# Altium project SR8_MPPT.PrjPcb (part 1 of 3)
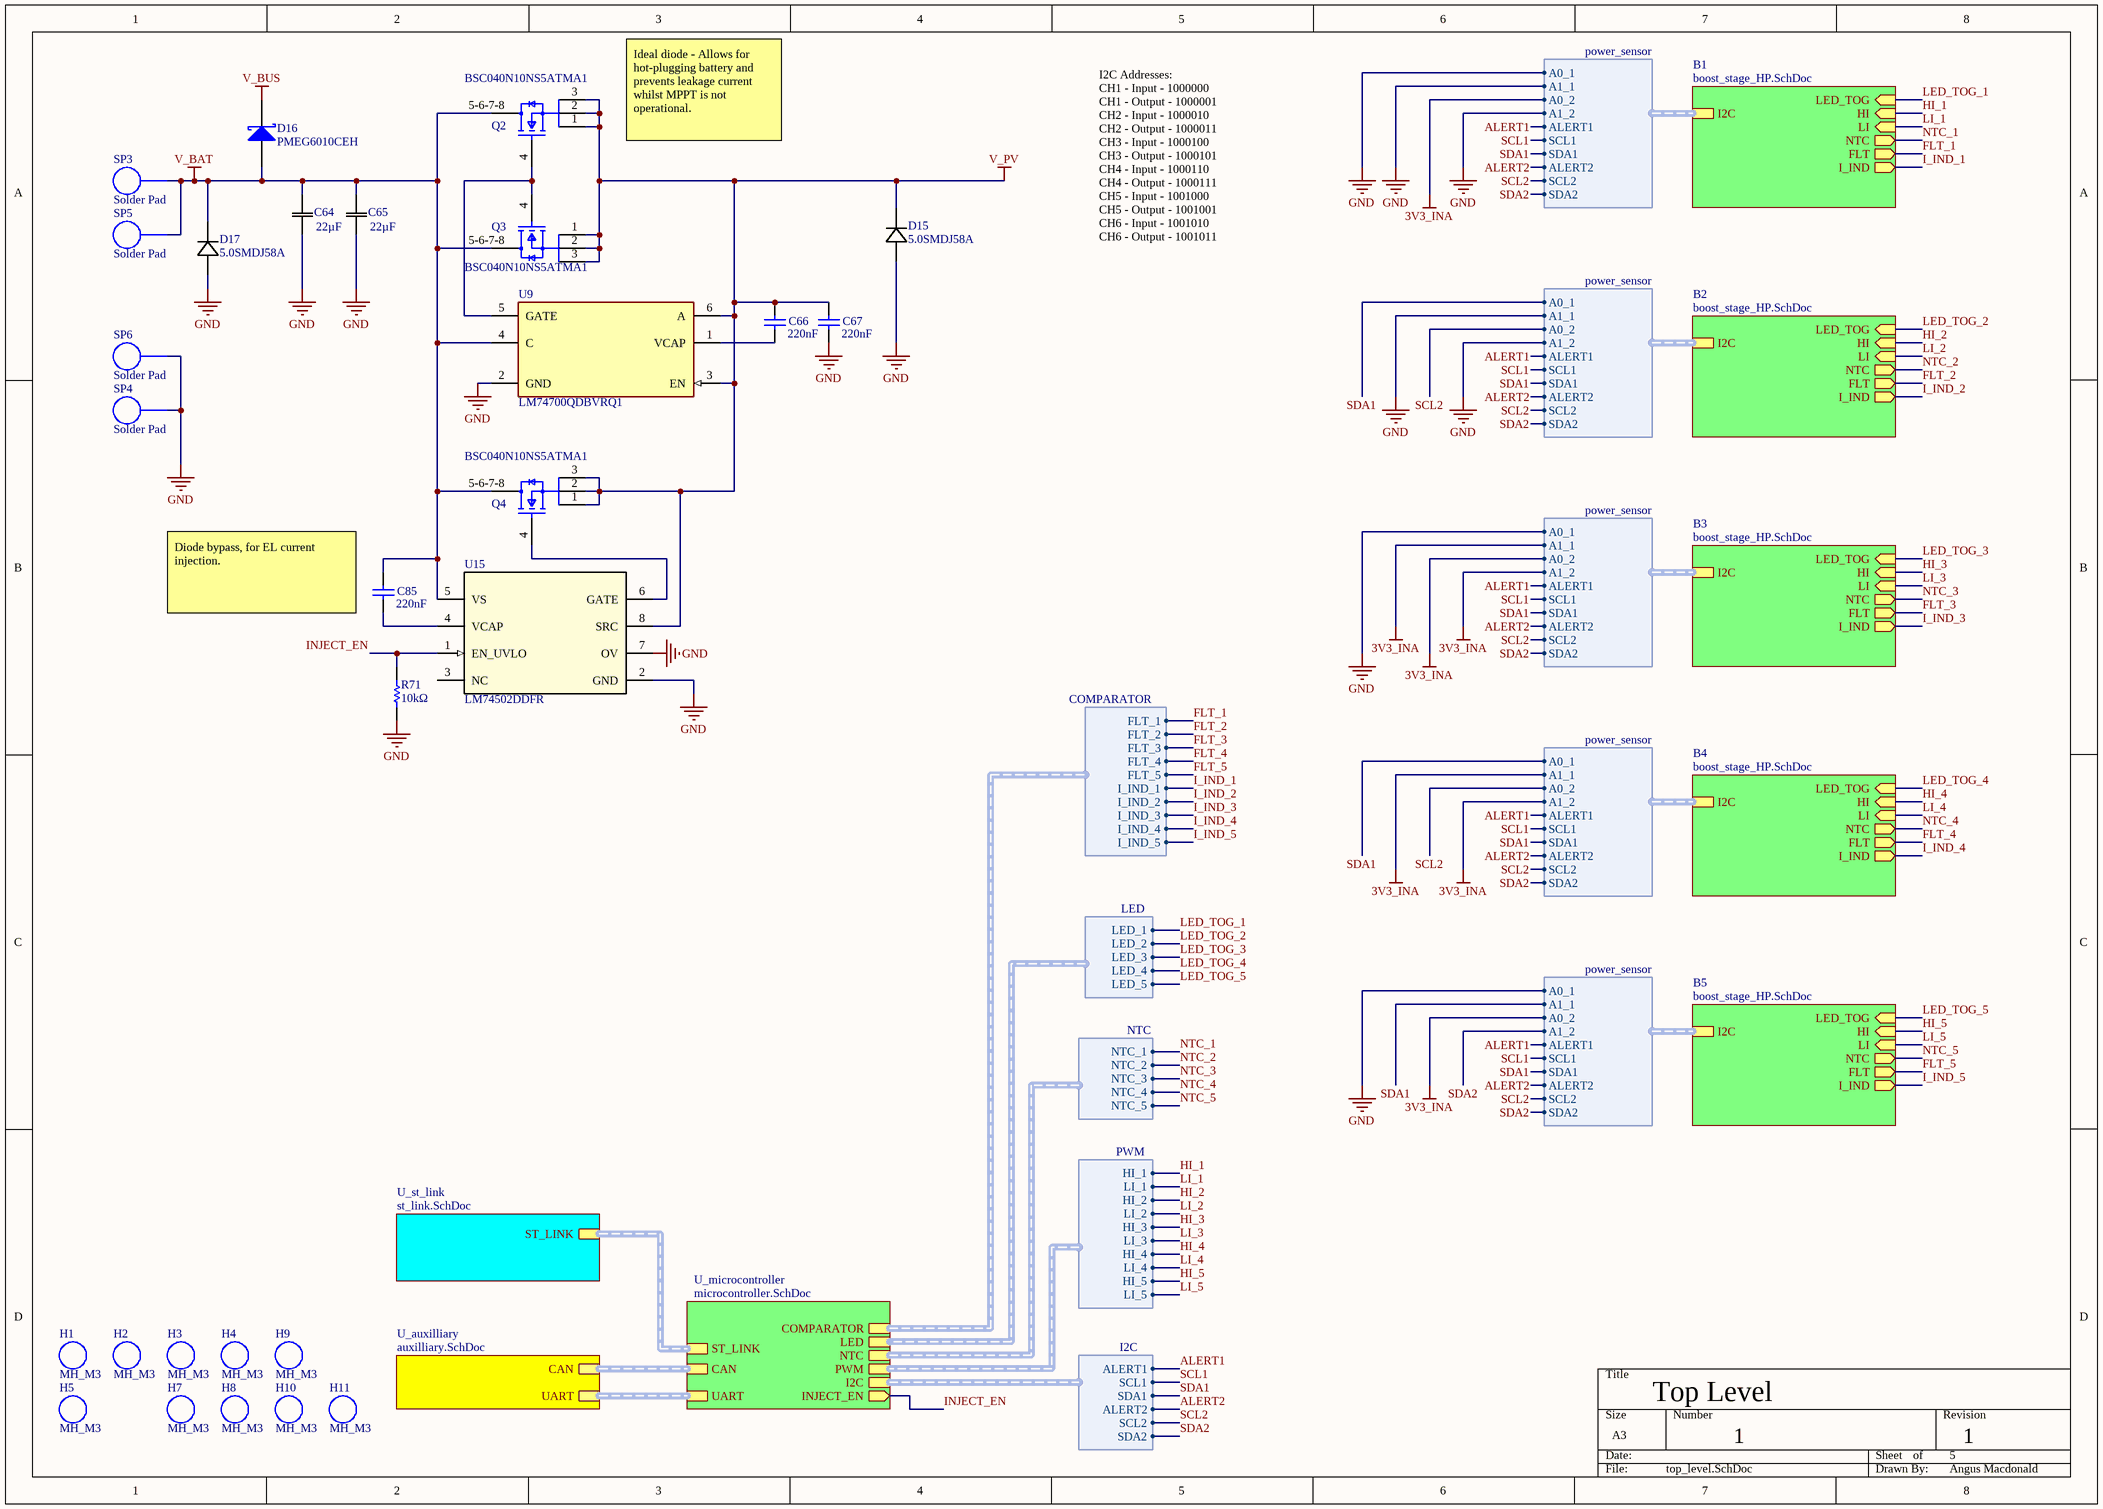
[diagram p0: top_level.SchDoc]
Revision: 1
5 sheets, 454 parts. Net scope: hierarchical (ports join the sheet entries above them; power ports are global).
Board file: mppt.PcbDoc
Sheets:
  top_level.SchDoc
    B1 = boost_stage_HP.SchDoc
    B2 = boost_stage_HP.SchDoc
    B3 = boost_stage_HP.SchDoc
    B4 = boost_stage_HP.SchDoc
    B5 = boost_stage_HP.SchDoc
    U_microcontroller = microcontroller.SchDoc
    U_st_link = st_link.SchDoc
    U_auxilliary = auxilliary.SchDoc

## Sheet top_level.SchDoc: Top Level
size A3; DrawnBy: Angus Macdonald; SheetNumber: 1; SheetTotal: 5

### Parts
C64  value 22µF  [CAP_EEE-FK2A220P_PAN]  (hidden comment: EEEFK2A220P)
C65  value 22µF  [CAP_EEE-FK2A220P_PAN]  (hidden comment: EEEFK2A220P)
C66  value 220nF  [C0805]  (hidden comment: CC0805KKX7R0BB224)
C67  value 220nF  [C0805]  (hidden comment: CC0805KKX7R0BB224)
C85  value 220nF  [C0805]  (hidden comment: CC0805KKX7R0BB224)
D15  5.0SMDJ58A  [5.0SMDJSeries_LTF]
D16  PMEG6010CEH  [FP-SOD123-IPC_A]
D17  5.0SMDJ58A  [5.0SMDJSeries_LTF]
H1  MH_M3  [MH_M3-Footprint-1]
H2  MH_M3  [MH_M3-Footprint-1]
H3  MH_M3  [MH_M3-Footprint-1]
H4  MH_M3  [MH_M3-Footprint-1]
H5  MH_M3  [MH_M3-Footprint-1]
H7  MH_M3  [MH_M3-Footprint-1]
H8  MH_M3  [MH_M3-Footprint-1]
H9  MH_M3  [MH_M3-Footprint-1]
H10  MH_M3  [MH_M3-Footprint-1]
H11  MH_M3  [MH_M3-Footprint-1]
Q2  BSC040N10NS5ATMA1  [FP-PG-TDSON-8-MFG]
Q3  BSC040N10NS5ATMA1  [FP-PG-TDSON-8-MFG]
Q4  BSC040N10NS5ATMA1  [FP-PG-TDSON-8-MFG]
R71  value 10kΩ  [RESC1608X55X25ML10T15]  (hidden comment: RC0603FR-0710KL)
SP3  Solder Pad  [Solder Pad-Footprint-1]
SP4  Solder Pad  [Solder Pad-Footprint-1]
SP5  Solder Pad  [Solder Pad-Footprint-1]
SP6  Solder Pad  [Solder Pad-Footprint-1]
U9  LM74700QDBVRQ1  [FP-DBV0006A-IPC_B]
U15  LM74502DDFR  [DDF0008A-IPC_A]

### Sub-sheets
B1 = boost_stage_HP.SchDoc: I2C (harness power_sensor), HI (in), LI (in), NTC (out), LED_TOG (in), FLT (out), I_IND (out)
B2 = boost_stage_HP.SchDoc: I2C (harness power_sensor), HI (in), LI (in), NTC (out), LED_TOG (in), FLT (out), I_IND (out)
B3 = boost_stage_HP.SchDoc: I2C (harness power_sensor), HI (in), LI (in), NTC (out), LED_TOG (in), FLT (out), I_IND (out)
B4 = boost_stage_HP.SchDoc: I2C (harness power_sensor), HI (in), LI (in), NTC (out), LED_TOG (in), FLT (out), I_IND (out)
B5 = boost_stage_HP.SchDoc: I2C (harness power_sensor), HI (in), LI (in), NTC (out), LED_TOG (in), FLT (out), I_IND (out)
U_auxilliary = auxilliary.SchDoc: CAN (harness CAN), UART (harness UART)
U_microcontroller = microcontroller.SchDoc: I2C (harness I2C), PWM (harness PWM), ST_LINK (harness ST_LINK), LED (harness LED), NTC (harness NTC), CAN (harness CAN), UART (harness UART), INJECT_EN (out), COMPARATOR (harness COMPARATOR)
U_st_link = st_link.SchDoc: ST_LINK (harness ST_LINK)

### Harnesses
power_sensor: A0_1, A1_1, A0_2, A1_2, ALERT1, SCL1, SDA1, ALERT2, SCL2, SDA2
PWM: HI_1, LI_1, HI_2, LI_2, HI_3, LI_3, HI_4, LI_4, HI_5, LI_5
I2C: ALERT1, SCL1, SDA1, ALERT2, SCL2, SDA2
NTC: NTC_1, NTC_2, NTC_3, NTC_4, NTC_5
LED: LED_1, LED_2, LED_3, LED_4, LED_5
COMPARATOR: FLT_1, FLT_2, FLT_3, FLT_4, FLT_5, I_IND_1, I_IND_2, I_IND_3, I_IND_4, I_IND_5

### Nets
3V3_INA: sheet B1/I2C.A0_2, sheet B3/I2C.A1_1, sheet B3/I2C.A0_2, sheet B3/I2C.A1_2, sheet B4/I2C.A1_1, sheet B4/I2C.A1_2, sheet B5/I2C.A0_2
GND: C64.1 C65.1 C67.1 D15.2 D17.2 R71.1 SP4.SP(Solder_Pad) SP6.SP(Solder_Pad) U9.2(GND) U15.2(GND) U15.7(OV) ; sheet B1/I2C.A0_1, sheet B1/I2C.A1_1, sheet B1/I2C.A1_2, sheet B2/I2C.A1_1, sheet B2/I2C.A1_2, sheet B3/I2C.A0_1, sheet B5/I2C.A0_1
V_BAT: C64.2 C65.2 C85.2 D16.2(A) D17.1 Q2.5-6-7-8(D) Q3.5-6-7-8(D) Q4.5-6-7-8(D) SP3.SP(Solder_Pad) SP5.SP(Solder_Pad) U9.4(C) U15.5(VS)
V_BUS: D16.1(K)
V_PV: C66.2 C67.2 D15.1 Q2.1(S) Q2.2(S) Q2.3(S) Q3.1(S) Q3.2(S) Q3.3(S) Q4.1(S) Q4.2(S) Q4.3(S) U9.3(EN) U9.6(A) U15.8(SRC)
ALERT1: sheet B1/I2C.ALERT1, sheet U_microcontroller/I2C.ALERT1, sheet B2/I2C.ALERT1, sheet B3/I2C.ALERT1, sheet B4/I2C.ALERT1, sheet B5/I2C.ALERT1
ALERT2: sheet B1/I2C.ALERT2, sheet U_microcontroller/I2C.ALERT2, sheet B2/I2C.ALERT2, sheet B3/I2C.ALERT2, sheet B4/I2C.ALERT2, sheet B5/I2C.ALERT2
FLT_1: sheet B1/FLT, sheet U_microcontroller/COMPARATOR.FLT_1
FLT_2: sheet B2/FLT, sheet U_microcontroller/COMPARATOR.FLT_2
FLT_3: sheet B3/FLT, sheet U_microcontroller/COMPARATOR.FLT_3
FLT_4: sheet B4/FLT, sheet U_microcontroller/COMPARATOR.FLT_4
FLT_5: sheet B5/FLT, sheet U_microcontroller/COMPARATOR.FLT_5
HI_1: sheet B1/HI, sheet U_microcontroller/PWM.HI_1
HI_2: sheet B2/HI, sheet U_microcontroller/PWM.HI_2
HI_3: sheet B3/HI, sheet U_microcontroller/PWM.HI_3
HI_4: sheet B4/HI, sheet U_microcontroller/PWM.HI_4
HI_5: sheet B5/HI, sheet U_microcontroller/PWM.HI_5
I_IND_1: sheet B1/I_IND, sheet U_microcontroller/COMPARATOR.I_IND_1
I_IND_2: sheet B2/I_IND, sheet U_microcontroller/COMPARATOR.I_IND_2
I_IND_3: sheet B3/I_IND, sheet U_microcontroller/COMPARATOR.I_IND_3
I_IND_4: sheet B4/I_IND, sheet U_microcontroller/COMPARATOR.I_IND_4
I_IND_5: sheet B5/I_IND, sheet U_microcontroller/COMPARATOR.I_IND_5
INJECT_EN: R71.2 U15.1(EN_UVLO) ; sheet U_microcontroller/INJECT_EN
LED_TOG_1: sheet B1/LED_TOG, sheet U_microcontroller/LED.LED_1
LED_TOG_2: sheet B2/LED_TOG, sheet U_microcontroller/LED.LED_2
LED_TOG_3: sheet B3/LED_TOG, sheet U_microcontroller/LED.LED_3
LED_TOG_4: sheet B4/LED_TOG, sheet U_microcontroller/LED.LED_4
LED_TOG_5: sheet B5/LED_TOG, sheet U_microcontroller/LED.LED_5
LI_1: sheet B1/LI, sheet U_microcontroller/PWM.LI_1
LI_2: sheet B2/LI, sheet U_microcontroller/PWM.LI_2
LI_3: sheet B3/LI, sheet U_microcontroller/PWM.LI_3
LI_4: sheet B4/LI, sheet U_microcontroller/PWM.LI_4
LI_5: sheet B5/LI, sheet U_microcontroller/PWM.LI_5
NTC_1: sheet B1/NTC, sheet U_microcontroller/NTC.NTC_1
NTC_2: sheet B2/NTC, sheet U_microcontroller/NTC.NTC_2
NTC_3: sheet B3/NTC, sheet U_microcontroller/NTC.NTC_3
NTC_4: sheet B4/NTC, sheet U_microcontroller/NTC.NTC_4
NTC_5: sheet B5/NTC, sheet U_microcontroller/NTC.NTC_5
SCL1: sheet B1/I2C.SCL1, sheet U_microcontroller/I2C.SCL1, sheet B2/I2C.SCL1, sheet B3/I2C.SCL1, sheet B4/I2C.SCL1, sheet B5/I2C.SCL1
SCL2: sheet B1/I2C.SCL2, sheet U_microcontroller/I2C.SCL2, sheet B2/I2C.A0_2, sheet B2/I2C.SCL2, sheet B3/I2C.SCL2, sheet B4/I2C.A0_2, sheet B4/I2C.SCL2, sheet B5/I2C.SCL2
SDA1: sheet B1/I2C.SDA1, sheet U_microcontroller/I2C.SDA1, sheet B2/I2C.A0_1, sheet B2/I2C.SDA1, sheet B3/I2C.SDA1, sheet B4/I2C.A0_1, sheet B4/I2C.SDA1, sheet B5/I2C.A1_1, sheet B5/I2C.SDA1
SDA2: sheet B1/I2C.SDA2, sheet U_microcontroller/I2C.SDA2, sheet B2/I2C.SDA2, sheet B3/I2C.SDA2, sheet B4/I2C.SDA2, sheet B5/I2C.A1_2, sheet B5/I2C.SDA2
NetC66_1: C66.1 U9.1(VCAP)
NetC85_1: C85.1 U15.4(VCAP)
NetQ2_4: Q2.4(G) Q3.4(G) U9.5(GATE)
NetQ4_4: Q4.4(G) U15.6(GATE)

Not connected (* = marked no-connect by the designer): U15 3(NC)

### Buses and harness runs
harness sheet U_auxilliary/CAN = sheet U_microcontroller/CAN
harness sheet U_auxilliary/UART = sheet U_microcontroller/UART
harness sheet U_microcontroller/ST_LINK = sheet U_st_link/ST_LINK

### Notes on the sheet
- Ideal diode - Allows for hot-plugging battery and prevents leakage current whilst MPPT is not operational.
- I2C Addresses:
  CH1 - Input - 1000000
  CH1 - Output - 1000001
  CH2 - Input - 1000010
  CH2 - Output - 1000011
  CH3 - Input - 1000100
  CH3 - Output - 1000101
  CH4 - Input - 1000110
  CH4 - Output - 1000111
  CH5 - Input - 1001000
  CH5 - Output - 1001001
  CH6 - Input - 1001010
  CH6 - Output - 1001011
- (near C85) Diode bypass, for EL current injection.

### Library data of the parts
C64 C65 = CMP-00270-3: Radial Can - SMD ALUMINUM ELECTROLYTIC CAPACITOR FK 100V 22muF ±20% 0.315Dia 8.00mm; Manufacturer Lifecycle Status: ACTIVE; Manufacturer_Name: Panasonic; Dissipation Factor: 7%; Impedance: 1.3Ω; Material: Aluminium; Ripple Current: 130mA; Polarity: Polar; Leakage Current: 22µA; Life (Hours): 2000hours; Lead Diameter: 900µm; Height - Seated (Max): 10.4902mm; Diameter: 8mm; Introduction Date: 2004-08-25; Pins: 2; Voltage Rating: 100V; Voltage Rating (DC): 100V; Case/Package: Radial; Number of Terminals: 2; Tolerance: 20%; REACH SVHC: Yes; Width: 8.3mm; Manufacturer_Part_Number: EEE-FK2A220P; Ratings: AEC-Q200; Max Operating Temperature: 105°C; Export Control Classification Number (ECCN) Code: EAR99; Source: EEE-FK2A220P.SchLib; Ripple Current (AC): 130mA; Min Operating Temperature: -55°C; RoHS: Compliant; Lifecycle Status: Production; Design Item ID: EEE-FK2A220P; Termination: SMD/SMT; Copyright: Copyright (C) 2025 Ultra Librarian. All rights reserved.; Country of Origin: Japan, Malaysia; Voltage: 100V; Part Series: FK; Harmonized Tariff Schedule (HTS) Code: 8532.22.00.20; Height: 10.2mm; Schedule B: 8532220020, 8532220020; Mounting Technology: Surface Mount; Lead Pitch: 3.1mm; Length: 10.2mm; Packaging: Cut Tape; Lead Free: Lead Free; ESR (Equivalent Series Resistance): 1.3Ω; Radiation Hardening: No
C66 C67 C85 = CMP-00180-1: Multilayer Ceramic Capacitors MLCC - SMD/SMT 100V 0.22uF X7R 0805 10%; Manufacturer Part Number: C2012X5R1A336M125AC; Positive Tolerance: 20%; Multilayer: Yes; Number of Terminals/Pins: 2; Capacitance: 33uF; Rated DC Voltage (URdc): 10V; Temperature Characteristics Code: X5R; RoHS Compliant: Yes; Package Style: SMTMeter; Schedule B: 8532240020, 8532240020; Dielectric: X7R; Termination: SMD/SMT; China RoHS: Compliant; Width: 1.25mm; Dielectric Material: Ceramic; Max Operating Temperature: 125°C; Mount: Surface Mount; Min Operating Temperature: -55°C; Tolerance: 10%; Weight: 5.499807mg; JESD-609 Code: e3; Thickness: 711.2µm; Length: 2mm; Case Code (Imperial): 0805; Package Shape: Rectangular; Negative Tolerance: 20%; REACH SVHC: Yes; Voltage Rating (DC): 100V; Case Code (Metric): 2012; Height: 1.25mm; Size Code: 0805; Mounting Technology: Surface Mount; Lifecycle Status: Production; Capacitor Type: Ceramic; Case/Package: 0805; Number of Terminals: 2; Packaging: Tape & Reel (TR); Voltage Rating: 100V; Composition: Ceramic; RoHS: Compliant; Terminal Finish: Nickel
D15 D17 = CMP-371-000000-3: Description; Manufacturer_Name: Littelfuse Inc; Copyright: Copyright (C) 2025 Ultra Librarian. All rights reserved.; Source: 5P0SMDJ58A.SchLib; Design Item ID: 5.0SMDJ58A; Manufacturer_Part_Number: 5.0SMDJ58A
D16 = CMP-002-000047-1: Rectifier Diode Schottky 1A Automotive 2-Pin SOD-123F / DIODE SCHOTTKY 60V 1A SOD123F; Element Configuration: Single; Number of Elements: 1; Peak Reverse Current: 50µA; Max Forward Surge Current (Ifsm): 9A; Max Power Dissipation: 375mW; Forward Voltage: 250mV; Lifecycle Status: Production; Export Control Classification Number (ECCN) Code: EAR99; Introduction Date: 2006-04-18; Contact Plating: Tin; Packaging: Cut Tape; China RoHS: Compliant; Termination: SMD/SMT; REACH SVHC: Yes; Min Operating Temperature: -65°C; Max Operating Temperature: 150°C; Country of Origin: Mainland China; Max Output current: 1A; Max Repetitive Reverse Voltage (Vrrm): 60V; Harmonized Tariff Schedule (HTS) Code: 8541.10.00.80; Pins: 2; Reverse Standoff Voltage: 60V; RoHS: Compliant; Number of Terminals: 2; Forward Current: 1A
H1-H5 H7-H11 = CMP-00278-2: Non-plated M3 Mounting hole.
Q2-Q4 = CMP-060-000024-2: On a Reel of 5000, N-Channel MOSFET, 100 A, 100 V, 8-Pin TDSON Infineon BSC040N10NS5ATMA1; Input Capacitance: 4.1nF; Max Dual Supply Voltage: 100V; Drain to Source Resistance: 4mΩ; Max Power Dissipation: 2.5W; Power Dissipation: 139W; Turn-On Delay Time: 13ns; Number of Elements: 1; Gate to Source Voltage (Vgs): 20V; Rise Time: 9ns; Max Junction Temperature (Tj): 150°C; Element Configuration: Single; Fall Time: 10ns; Continuous Drain Current (ID): 18A; Turn-Off Delay Time: 32ns; Lifecycle Status: Production; Packaging: Tape & Reel; Halogen Free: Halogen Free; Weight: 506.605978mg; Mounting Technology: Surface Mount; Max Operating Temperature: 150°C; Export Control Classification Number (ECCN) Code: EAR99; Height: 1.1mm; Number of Terminals: 5; Min Breakdown Voltage: 100V; On-State Resistance: 4mΩ; Contact Plating: Tin; Number of Channels: 1; China RoHS: Non-Compliant; Pins: 8; Introduction Date: 2015-01-07; Lead Free: Contains Lead; Drain to Source Breakdown Voltage: 100V; Drain to Source Voltage (Vdss): 100V; REACH SVHC: No; Package Quantity: 5000; RoHS: Compliant; Rds On Max: 4mΩ; Schedule B: 8541290080, 8541290080; Country of Origin: Austria, Germany, Mainland China, Malaysia; Min Operating Temperature: -55°C
R71 = CMP-RES-00040-1: 10 kOhms ±1% 0.1W, 1/10W Chip Resistor 0603 (1608 Metric) Moisture Resistant Thick Film; Tolerance: 1%; Case/Package: 0603
SP3-SP6 = CMP-014-000043-5: 64mm^2 solder pad for wire to board connections,
U9 = CMP-015-000057-1: 3.2-V to 65-V, 80-uA IQ automotive ideal diode controller 6-SOT-23 -40 to 125; Manufacturer Lifecycle Status: ACTIVE; Min Supply Voltage: 3.2V; Max Junction Temperature (Tj): 150°C; Nominal Supply Current: 80µA; Max Supply Voltage: 65V; Number of Outputs: 1; Width: 1.6mm; RoHS: Compliant; Length: 2.9mm; Schedule B: 8542390000; Height: 0m; Max Operating Temperature: 125°C; Lifecycle Status: Production; Pins: 6; Case/Package: SOT-23; Thickness: 1.2mm; Ambient Temperature Range High: 125°C; Min Operating Temperature: -40°C
U15 = CMP-050-000033-2: 3.2-V to 65-V industrial RPP controller with load disconnect and OVP 8-SOT-23-THIN -40 to 125; Manufacturer_Name: Texas Instruments; Source: LM74502DDFR.SchLib; RefDes: RefDes; TYPE: TYPE; Manufacturer_Part_Number: LM74502DDFR; Copyright: Copyright (C) 2026 Ultra Librarian. All rights reserved.; Design Item ID: LM74502DDFR

## Sheet boost_stage_HP.SchDoc: Boost Stage
size A3; DrawnBy: Angus Macdonald; SheetNumber: 3; SheetTotal: 5
Used 5 times, as channels B1, B2, B3, B4, B5. Parts and nets are listed once, with the designators drawn on the sheet.
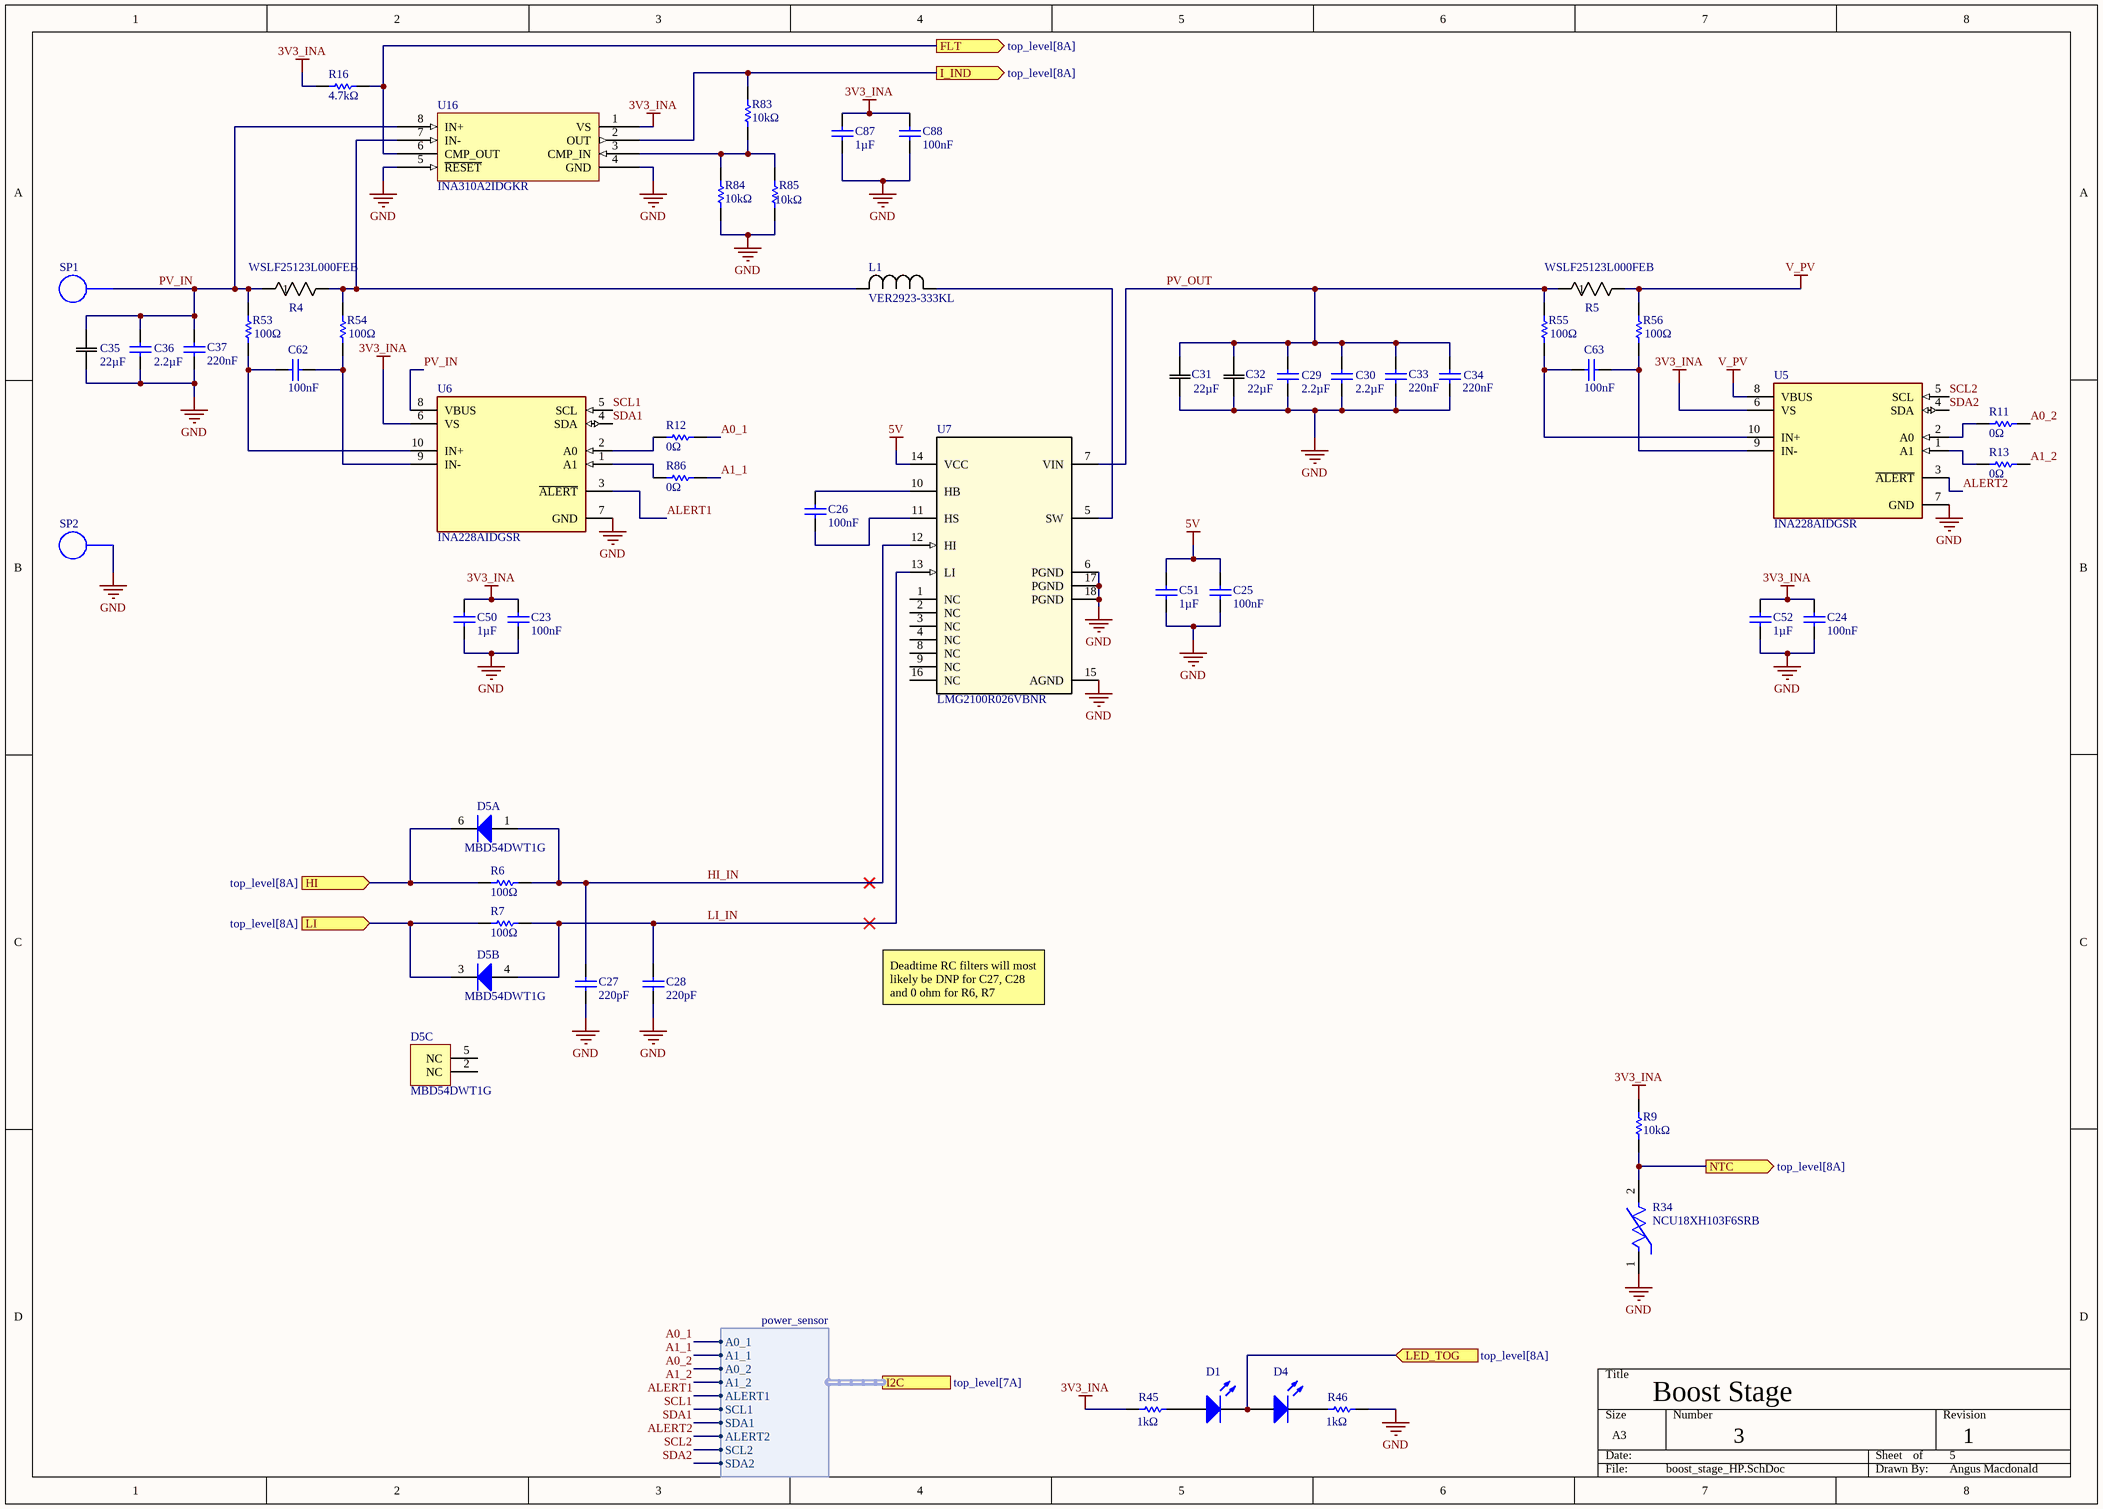
[diagram p1: boost_stage_HP.SchDoc]

### Parts
C23  value 100nF  [C0603]  (hidden comment: CC0603KRX7R8BB104)
C24  value 100nF  [C0603]  (hidden comment: CC0603KRX7R8BB104)
C25  value 100nF  [C0603]  (hidden comment: CC0603KRX7R8BB104)
C26  value 100nF  [C0603]  (hidden comment: CC0603KRX7R8BB104)
C27  value 220pF  [C0603]  (hidden comment: CC0603JRNPO9BN221)
C28  value 220pF  [C0603]  (hidden comment: CC0603JRNPO9BN221)
C29  value 2.2µF  [FP-CC1206-1_25-IPC_B]  (hidden comment: CC1206KKX7R0BB225)
C30  value 2.2µF  [FP-CC1206-1_25-IPC_B]  (hidden comment: CC1206KKX7R0BB225)
C31  value 22µF  [CAP_EEE-FK2A220P_PAN]  (hidden comment: EEEFK2A220P)
C32  value 22µF  [CAP_EEE-FK2A220P_PAN]  (hidden comment: EEEFK2A220P)
C33  value 220nF  [C0805]  (hidden comment: CC0805KKX7R0BB224)
C34  value 220nF  [C0805]  (hidden comment: CC0805KKX7R0BB224)
C35  value 22µF  [CAP_EEE-FK2A220P_PAN]  (hidden comment: EEEFK2A220P)
C36  value 2.2µF  [FP-CC1206-1_25-IPC_B]  (hidden comment: CC1206KKX7R0BB225)
C37  value 220nF  [C0805]  (hidden comment: CC0805KKX7R0BB224)
C50  value 1µF  [C0603]  (hidden comment: CC0603KRX7R7BB105)
C51  value 1µF  [C0603]  (hidden comment: CC0603KRX7R7BB105)
C52  value 1µF  [C0603]  (hidden comment: CC0603KRX7R7BB105)
C62  value 100nF  [C0603]  (hidden comment: CC0603JRX7R0BB104)
C63  value 100nF  [C0603]  (hidden comment: CC0603JRX7R0BB104)
C87  value 1µF  [C0603]  (hidden comment: CC0603KRX7R7BB105)
C88  value 100nF  [C0603]  (hidden comment: CC0603KRX7R8BB104)
D1  LED EMERALD 0805  [0805 LED]  (value not drawn)
D4  LED RED 0805  [0805 LED]  (value not drawn)
D5  MBD54DWT1G  [ONSC-SOT-363-6-419B-02_W_V]  (parts A,B,C of 3)
L1  VER2923-333KL  [IND_VER2923_COC]
R4  WSLF25123L000FEB  [RES_3L000FEB_VIS]
R5  WSLF25123L000FEB  [RES_3L000FEB_VIS]
R6  value 100Ω  [RESC1608X55X25ML10T15]  (hidden comment: RC0603FR-07100RL)
R7  value 100Ω  [RESC1608X55X25ML10T15]  (hidden comment: RC0603FR-07100RL)
R9  value 10kΩ  [RESC1608X55X25ML10T15]  (hidden comment: RC0603FR-0710KL)
R11  value 0Ω  [RESC1608X55X25ML10T15]  (hidden comment: RC0603JR-070RL)
R12  value 0Ω  [RESC1608X55X25ML10T15]  (hidden comment: RC0603JR-070RL)
R13  value 0Ω  [RESC1608X55X25ML10T15]  (hidden comment: RC0603JR-070RL)
R16  value 4.7kΩ  [RESC1608X55X25ML10T15]  (hidden comment: RC0603FR-074K7L)
R34  NCU18XH103F6SRB  [FP-NCU18-0_15-IPC_A]
R45  value 1kΩ  [RESC1608X55X25ML10T15]  (hidden comment: RC0603FR-101KL)
R46  value 1kΩ  [RESC1608X55X25ML10T15]  (hidden comment: RC0603FR-101KL)
R53  value 100Ω  [RESC1608X55X25ML10T15]  (hidden comment: RC0603FR-07100RL)
R54  value 100Ω  [RESC1608X55X25ML10T15]  (hidden comment: RC0603FR-07100RL)
R55  value 100Ω  [RESC1608X55X25ML10T15]  (hidden comment: RC0603FR-07100RL)
R56  value 100Ω  [RESC1608X55X25ML10T15]  (hidden comment: RC0603FR-07100RL)
R83  value 10kΩ  [RESC1608X55X25ML10T15]  (hidden comment: RC0603FR-0710KL)
R84  value 10kΩ  [RESC1608X55X25ML10T15]  (hidden comment: RC0603FR-0710KL)
R85  value 10kΩ  [RESC1608X55X25ML10T15]  (hidden comment: RC0603FR-0710KL)
R86  value 0Ω  [RESC1608X55X25ML10T15]  (hidden comment: RC0603JR-070RL)
SP1  Solder Pad  [Solder Pad-Footprint-1]  (value not drawn)
SP2  Solder Pad  [Solder Pad-Footprint-1]  (value not drawn)
U5  INA228AIDGSR  [FP-DGS0010A-IPC_C]
U6  INA228AIDGSR  [FP-DGS0010A-IPC_C]
U7  LMG2100R026VBNR  [VBN0018A-MFG]
U16  INA310A2IDGKR  [VSSOP8_DGK_TEX]

### Ports
FLT (out, see top_level[8A]), HI (in, see top_level[8A]), I2C (harness power_sensor, see top_level[7A]), I_IND (out, see top_level[8A]), LED_TOG (in, see top_level[8A]), LI (in, see top_level[8A]), NTC (out, see top_level[8A])

### Harnesses
power_sensor: A0_1, A1_1, A0_2, A1_2, ALERT1, SCL1, SDA1, ALERT2, SCL2, SDA2

### Nets
3V3_INA: C23.2 C24.2 C50.2 C52.2 C87.2 C88.2 R9.2 R16.2 R45.1 U5.6(VS) U6.6(VS) U16.1(VS)
5V: C25.2 C51.2 U7.14(VCC)
GND: C23.1 C24.1 C25.1 C27.1 C28.1 C29.2 C30.2 C31.1 C32.1 C33.1 C34.1 C35.1 C36.2 C37.1 C50.1 C51.1 C52.1 C87.1 C88.1 R34.1 R46.2 R84.1 R85.1 SP2.SP(Solder_Pad) U5.7(GND) U6.7(GND) U7.6(PGND) U7.15(AGND) U7.17(PGND) U7.18(PGND) U16.4(GND) U16.5(~{RESET})
V_PV: R5.2 R56.2 U5.8(VBUS)
A0_1: R12.1 ; port I2C.A0_1
A0_2: R11.2 ; port I2C.A0_2
A1_1: R86.1 ; port I2C.A1_1
A1_2: R13.2 ; port I2C.A1_2
ALERT1: U6.3(~{ALERT}) ; port I2C.ALERT1
ALERT2: U5.3(~{ALERT}) ; port I2C.ALERT2
FLT: R16.1 U16.6(CMP_OUT) ; port FLT
HI: D5.6(K2) R6.2 ; port HI
HI_IN: C27.2 D5.1(A2) R6.1 U7.12(HI)
I_IND: R83.2 U16.2(OUT) ; port I_IND
LED_TOG: D1.K D4.A ; port LED_TOG
LI: D5.3(K1) R7.2 ; port LI
LI_IN: C28.2 D5.4(A1) R7.1 U7.13(LI)
NTC: R9.1 R34.2 ; port NTC
PV_IN: C35.2 C36.1 C37.2 R4.1 R53.2 SP1.SP(Solder_Pad) U6.8(VBUS) U16.8(IN+)
PV_OUT: C29.1 C30.1 C31.2 C32.2 C33.2 C34.2 R5.1 R55.2 U7.7(VIN)
SCL1: U6.5(SCL) ; port I2C.SCL1
SCL2: U5.5(SCL) ; port I2C.SCL2
SDA1: U6.4(SDA) ; port I2C.SDA1
SDA2: U5.4(SDA) ; port I2C.SDA2
NetC26_1: C26.1 U7.11(HS)
NetC26_2: C26.2 U7.10(HB)
NetC62_1: C62.1 R54.1 U6.9(IN-)
NetC62_2: C62.2 R53.1 U6.10(IN+)
NetC63_1: C63.1 R56.1 U5.9(IN-)
NetC63_2: C63.2 R55.1 U5.10(IN+)
NetD1_A: D1.A R45.2
NetD4_K: D4.K R46.1
NetL1_1: L1.1 U7.5(SW)
NetL1_2: L1.2 R4.2 R54.2 U16.7(IN-)
NetR11_1: R11.1 U5.2(A0)
NetR12_2: R12.2 U6.2(A0)
NetR13_1: R13.1 U5.1(A1)
NetR83_1: R83.1 R84.2 R85.2 U16.3(CMP_IN)
NetR86_2: R86.2 U6.1(A1)

Not connected (* = marked no-connect by the designer): D5 2(NC) 5(NC); U7 1(NC) 2(NC) 3(NC) 4(NC) 8(NC) 9(NC) 16(NC)

### Channels
B1: designators end in _B1; ports FLT=FLT_1 HI=HI_1 I_IND=I_IND_1 LED_TOG=LED_TOG_1 LI=LI_1 NTC=NTC_1
B2: designators end in _B2; ports FLT=FLT_2 HI=HI_2 I_IND=I_IND_2 LED_TOG=LED_TOG_2 LI=LI_2 NTC=NTC_2
B3: designators end in _B3; ports FLT=FLT_3 HI=HI_3 I_IND=I_IND_3 LED_TOG=LED_TOG_3 LI=LI_3 NTC=NTC_3
B4: designators end in _B4; ports FLT=FLT_4 HI=HI_4 I_IND=I_IND_4 LED_TOG=LED_TOG_4 LI=LI_4 NTC=NTC_4
B5: designators end in _B5; ports FLT=FLT_5 HI=HI_5 I_IND=I_IND_5 LED_TOG=LED_TOG_5 LI=LI_5 NTC=NTC_5

### Notes on the sheet
- Deadtime RC filters will most likely be DNP for C27, C28 and 0 ohm for R6, R7

### Library data of the parts
C23-C26 C88 = CMP-00179-1: 25V 100nF X7R ±10% 0603 Multilayer Ceramic Capacitors MLCC - SMD/SMT ROHS; Length: 1.6mm; Pins: 2; Case/Package: 0603; Composition: Ceramic; Lead Free: Lead Free; Lifecycle Status: Production; RoHS: Compliant; China RoHS: Compliant; Number of Terminals: 2; Max Operating Temperature: 125°C; Tolerance: 10%; Width: 800µm; Dielectric Material: Ceramic; Voltage Rating (DC): 25V; Depth: 800µm; Min Operating Temperature: -55°C; Halogen Free: Halogen Free; Mounting Technology: Surface Mount; Material: Ceramic; REACH SVHC: Yes; Case Code (Imperial): 0603; Height: 800µm; Schedule B: 8532240020, 8532240020; Voltage Rating: 25V; Thickness: 889µm; Termination: SMD/SMT; Dielectric: X7R; Radiation Hardening: No; Voltage: 25V; Case Code (Metric): 1608
C27 C28 = CMP-00294-1: 50V 220pF NP0 ±5% 0603 Multilayer Ceramic Capacitors MLCC - SMD/SMT ROHS; Insulation Resistance: 100GΩ; Temperature Coefficient: 30ppm/°C; Dielectric: C0G; Case Code (Imperial): 0603; Introduction Date: 2005-07-07; Dielectric Material: Ceramic; Radiation Hardening: No; Voltage Rating: 50V; Number of Terminals: 2; Schedule B: 8532240020, 8532240020; Halogen Free: Halogen Free; Max Operating Temperature: 125°C; Voltage Rating (DC): 50V; Pins: 2; Export Control Classification Number (ECCN) Code: EAR99; Min Operating Temperature: -55°C; REACH SVHC: Yes; RoHS: Compliant; Thickness: 889µm; Composition: Ceramic; Termination: SMD/SMT; Voltage Rating (AC): 50V; China RoHS: Compliant; Width: 800µm; Voltage: 50V; Lifecycle Status: Production; Tolerance: 5%; Height: 800µm; Case/Package: 0603; Depth: 800µm; Lead Free: Lead Free; Mounting Technology: Surface Mount; Length: 1.6mm; Country of Origin: Mainland China, Taiwan; Harmonized Tariff Schedule (HTS) Code: 8532.24.00.20
C29 C30 C36 = CMP-00184-1: 1206 2.2 uF 100 V ±10% Tolerance X7R SMT Multilayer Ceramic Chip Capacitor; Voltage Rating: 100V; Lifecycle Status: Production; RoHS: Compliant; REACH SVHC: Yes; Height: 1.6mm; Schedule B: 8532240020, 8532240020; Max Operating Temperature: 125°C; Number of Terminals: 2; Dielectric Material: Ceramic; Width: 1.6mm; Case/Package: 1206; Length: 3.2mm; Thickness: 1.4478mm; Tolerance: 10%; Min Operating Temperature: -55°C; Mounting Technology: Surface Mount; Material: Ceramic; Voltage Rating (DC): 100V; China RoHS: Compliant
C31 C32 C35 = CMP-00270-3: as C64 on sheet top_level; Height - Seated (Max): 10.4902mm; Diameter: 8mm; Introduction Date: 2004-08-25; Pins: 2; Voltage Rating: 100V; Voltage Rating (DC): 100V; Case/Package: Radial; Number of Terminals: 2; Tolerance: 20%; REACH SVHC: Yes; Width: 8.3mm; Manufacturer_Part_Number: EEE-FK2A220P; Ratings: AEC-Q200; Max Operating Temperature: 105°C; Export Control Classification Number (ECCN) Code: EAR99; Source: EEE-FK2A220P.SchLib; Ripple Current (AC): 130mA; Min Operating Temperature: -55°C; RoHS: Compliant; Lifecycle Status: Production; Design Item ID: EEE-FK2A220P; Termination: SMD/SMT; Copyright: Copyright (C) 2025 Ultra Librarian. All rights reserved.; Country of Origin: Japan, Malaysia; Voltage: 100V; Part Series: FK; Harmonized Tariff Schedule (HTS) Code: 8532.22.00.20; Height: 10.2mm; Schedule B: 8532220020, 8532220020; Mounting Technology: Surface Mount; Lead Pitch: 3.1mm; Length: 10.2mm; Packaging: Cut Tape; Lead Free: Lead Free; ESR (Equivalent Series Resistance): 1.3Ω; Radiation Hardening: No
C33 C34 C37 = CMP-00180-1: as C66 on sheet top_level; RoHS Compliant: Yes; Package Style: SMTMeter; Schedule B: 8532240020, 8532240020; Dielectric: X7R; Termination: SMD/SMT; China RoHS: Compliant; Width: 1.25mm; Dielectric Material: Ceramic; Max Operating Temperature: 125°C; Mount: Surface Mount; Min Operating Temperature: -55°C; Tolerance: 10%; Weight: 5.499807mg; JESD-609 Code: e3; Thickness: 711.2µm; Length: 2mm; Case Code (Imperial): 0805; Package Shape: Rectangular; Negative Tolerance: 20%; REACH SVHC: Yes; Voltage Rating (DC): 100V; Case Code (Metric): 2012; Height: 1.25mm; Size Code: 0805; Mounting Technology: Surface Mount; Lifecycle Status: Production; Capacitor Type: Ceramic; Case/Package: 0805; Number of Terminals: 2; Packaging: Tape & Reel (TR); Voltage Rating: 100V; Composition: Ceramic; RoHS: Compliant; Terminal Finish: Nickel
C50-C52 C87 = CMP-00211-1: 16V 1uF X7R ±10% 0603 Multilayer Ceramic Capacitors MLCC - SMD/SMT ROHS; Dissipation Factor: 5%; Harmonized Tariff Schedule (HTS) Code: 8532.24.00.20; Width: 800µm; Country of Origin: Mainland China, Taiwan; Case Code (Imperial): 0603; Schedule B: 8532240020, 8532240020; Halogen Free: Halogen Free; Lifecycle Status: Production; China RoHS: Compliant; Max Operating Temperature: 125°C; Export Control Classification Number (ECCN) Code: EAR99; Min Operating Temperature: -55°C; Radiation Hardening: No; Dielectric Material: Ceramic; Voltage: 16V; RoHS: Compliant; Voltage Rating (DC): 16V; Termination: SMD/SMT; Material: Ceramic; Mounting Technology: Surface Mount; Case Code (Metric): 1608; Case/Package: 0603; Depth: 800µm; Voltage Rating: 16V; Dielectric: X7R; Thickness: 889µm; Lead Free: Lead Free; Length: 1.6mm; REACH SVHC: Yes; Height: 800µm; Introduction Date: 2009-04-17; Tolerance: 10%; Composition: Ceramic; Number of Terminals: 2; Pins: 2
C62 C63 = CMP-00275-1: Ceramic Capacitor, Ceramic, 100V, 5% +Tol, 5% -Tol, X7R, 0.15 TC, 0.1uF, Surface Mount, 0603; RoHS: Compliant; Voltage Rating (DC): 100V; Length: 1.6mm; Dielectric Material: Ceramic; REACH SVHC: Yes; Case/Package: 0603; China RoHS: Compliant; Mounting Technology: Surface Mount; Height: 800µm; Lifecycle Status: Production; Width: 800µm; Min Operating Temperature: -55°C; Number of Terminals: 2; Max Operating Temperature: 125°C
D1 = CMP-002-000017-2: Emerald 0805  Light Emitting Diodes (LED) ROHS GREEN JLCPCB PICK&PLACE; MFR.Part #: C2297; Manufacturer: Hubei KENTO Elec; Color: Emerald; JLCPCB Part #: C2297
D4 = CMP-002-000018-2: Red 0805  Light Emitting Diodes (LED) ROHS JLCPCB PICK&PLACE; Manufacturer: Foshan NationStar Optoelectronics; MFR.Part #: C84256; JLCPCB Part #: C84256; Color: Red
D5 = CMP-002-000050-1: MBD54DWT1G Series 30 V 600 mA Dual Schottky Barrier Diode - SOT-363; Manufacturer Lifecycle Status: ACTIVE; Max Forward Surge Current (Ifsm): 600mA; Max Reverse Voltage (DC): 30V; Forward Current: 200mA; Number of Elements: 2; Max Power Dissipation: 150mW; Reverse Standoff Voltage: 25V; Recovery Time: 5ns; Max Reverse Leakage Current: 2µA; Forward Voltage: 1V; Value: 10pF; Pins: 6; Number of Terminals: 6; Min Operating Temperature: -55°C; Height: 1mm; China RoHS: Compliant; Current Rating: 200mA; Halogen Free: Halogen Free; Lifecycle Status: Production; Max Surge Current: 600mA; Harmonized Tariff Schedule (HTS) Code: 8541.10.00.70; Packaging: Tape and Reel; Length: 2.2mm; Voltage Rating (DC): 30V; Element Configuration: Dual; Introduction Date: 2000-08-27; Schedule B: 8541100070, 8541100070; Lead Free: Lead Free; Max Repetitive Reverse Voltage (Vrrm): 30V; REACH SVHC: Yes; Max Operating Temperature: 125°C; Termination: SMD/SMT; Contact Plating: Tin; Country of Origin: Mainland China; Reverse Recovery Time: 5ns; Export Control Classification Number (ECCN) Code: EAR99; Case/Package: SOT-363-6; Peak Reverse Current: 2µA; Width: 1.35mm; Average Rectified Current: 200mA; Max Output current: 200mA; RoHS: Compliant; Peak Non-Repetitive Surge Current: 600mA; Radiation Hardening: No; Power Dissipation: 150mW; Min Breakdown Voltage: 30V
L1 = CMP-050-000031-4: Description; Manufacturer_Name: Coilcraft; Manufacturer_Part_Number: VER2923-333KL; Copyright: Copyright (C) 2026 Ultra Librarian. All rights reserved.; Source: VER2923-333KL.SchLib; Design Item ID: VER2923-333KL
R4 R5 = CMP-RES-00090-4: WSLF2512 .003 1% EB e3; Manufacturer_Name: Vishay; Copyright: Copyright (C) 2026 Ultra Librarian. All rights reserved.; Source: WSLF25123L000FEB.SchLib; Datasheet: https://www.vishay.com/doc?30193; Manufacturer_Part_Number: WSLF25123L000FEB; Design Item ID: WSLF25123L000FEB
R6 R7 R53-R56 = CMP-RES-00083-1: Yageo RC0603FR-07100RL 0603 SMD Resistor 100 Ohm thin film chip resistor; Temperature Coefficient: 100ppm/°C; Working Voltage: 75V; Power Dissipation: 100mW; Voltage Rating (DC): 50V; Tolerance: 1%; Lead Free: Lead Free; Lifecycle Status: Production; Packaging: Cut Tape (CT); Height: 450µm; Pins: 2; Contact Plating: Tin; Mounting Technology: Surface Mount; Length: 1.6mm; Termination: SMD/SMT; Max Operating Temperature: 155°C; Width: 800µm; Case Code (Metric): 0603; Power Rating: 100mW; Voltage Rating: 75V; RoHS: Compliant; Depth: 800µm; Military Standard: Not; Min Operating Temperature: -55°C; Composition: Thick Film; Radiation Hardening: No; Case/Package: 0603; REACH SVHC: Yes; Number of Terminals: 2; Case Code (Imperial): 0603; China RoHS: Non-Compliant; Schedule B: 8533210045, 8533210045
R9 R83-R85 = CMP-RES-00040-1: as R71 on sheet top_level; Tolerance: 1%; Case/Package: 0603
R11-R13 R86 = CMP-RES-00050-1: GENERAL PURPOSE CHIP RESISTOR Metal Glaze/thick Film, 0.1W, 0ohm, Surface Mount, 0603; Power Rating: 100mW; Tolerance: 1%; Voltage Rating: 50V; Temperature Coefficient: 200ppm/°C; Termination: SMD/SMT; Number of Terminals: 2; Pins: 2; Contact Plating: Tin; Case/Package: 0603; Length: 1.6mm; Military Standard: Not; Power Dissipation: 100mW; Introduction Date: 2001-06-08; Case Code (Imperial): 0603; Voltage Rating (DC): 50V; Min Operating Temperature: -55°C; Composition: Thick Film; Export Control Classification Number (ECCN) Code: EAR99; Country of Origin: Mainland China, Taiwan; Height: 450µm; RoHS: Compliant; Depth: 800µm; Lifecycle Status: Production; Width: 800µm; Max Operating Temperature: 155°C; Harmonized Tariff Schedule (HTS) Code: 8533.21.00.30; Radiation Hardening: No; Packaging: Cut Tape; China RoHS: Non-Compliant; Lead Free: Lead Free; REACH SVHC: Yes; Mounting Technology: Surface Mount
R16 = CMP-RES-00087-1: Yageo RC0603FR-074K7L Resistor 0603 SMD 4.7k Ohm 1% 100mW Thick Film; Working Voltage: 75V; Voltage Rating (DC): 50V; Temperature Coefficient: 100ppm/°C; Pins: 2; Mounting Technology: Surface Mount; China RoHS: Non-Compliant; Number of Terminals: 2; Radiation Hardening: No; Export Control Classification Number (ECCN) Code: EAR99; Country of Origin: Mainland China, Taiwan; Packaging: Tape & Reel; REACH SVHC: Yes; Composition: Thick Film; Schedule B: 8533210045, 8533210045; Height: 450µm; Case/Package: 0603; Contact Plating: Tin; Tolerance: 1%; Length: 1.6mm; Termination: SMD/SMT; Lead Free: Lead Free; RoHS: Compliant; Power Rating: 100mW; Voltage Rating: 75V; Case Code (Imperial): 0603; Max Operating Temperature: 155°C; Width: 800µm; Depth: 800µm; Lifecycle Status: Production; Harmonized Tariff Schedule (HTS) Code: 8533.21.00.30; Introduction Date: 2004-09-22; Min Operating Temperature: -55°C; Lead Pitch: 300µm; Military Standard: Not
R34 = CMP-00271-1: NTC Thermistors; MURATA; NCU18XH103F6SRB; 10 kOhm; 1 %; 0603; 950 µm; Tolerance: 1%; Working Voltage: 5V; Value: 10kΩ; Max Current Rating: 100µA; Mounting Technology: Surface Mount; Case Code (Metric): 1608; Lifecycle Status: Production; Harmonized Tariff Schedule (HTS) Code: 8533.40.80.70; Width: 800µm; Number of Terminals: 2; Height: 800µm; Length: 1.6mm; RoHS: Compliant; Schedule B: 8533400080, 8533400080; Min Operating Temperature: -55°C; Export Control Classification Number (ECCN) Code: EAR99; Case/Package: 0603; Voltage Rating: 5V; Introduction Date: 2016-05-16; REACH SVHC: Yes; Ratings: AEC-Q200; Case Code (Imperial): 0603; Max Operating Temperature: 150°C
R45 R46 = CMP-RES-00029-1: 1 kOhms ±1% 0.1W, 1/10W Chip Resistor 0603 (1608 Metric) Moisture Resistant Thick Film; Case/Package: 0603; Tolerance: 1%
SP1 SP2 = CMP-014-000043-5: as SP3 on sheet top_level
U5 U6 = CMP-015-000056-2: General Purpose Amplifiers; INA228AIDGSR; TEXAS INSTRUMENTS; 10; 3 mm; 3 mm; 5.5 V; Manufacturer Lifecycle Status: ACTIVE; Number of Channels: 1; Input Bias Current: 10nA; Max Junction Temperature (Tj): 150°C; Output Current: 10mA; Min Supply Voltage: 2.7V; Max Supply Voltage: 5.5V; Input Offset Voltage (Vos): 1mV; Nominal Supply Current: 640µA; Lifecycle Status: Production; Ambient Temperature Range High: 125°C; Height: 1.07mm; Min Operating Temperature: -40°C; RoHS: Compliant; Width: 3mm; Case/Package: VSSOP; Max Operating Temperature: 125°C; Length: 3mm; Thickness: 1.02mm; Pins: 10
U7 = CMP-240-000000-3: 100V 2.6mâ„; Manufacturer_Name: Texas Instruments; Copyright: Copyright (C) 2025 Ultra Librarian. All rights reserved.; RefDes: RefDes; Source: LMG2100R026VBNR.SchLib; Design Item ID: LMG2100R026VBNR; TYPE: TYPE; Manufacturer_Part_Number: LMG2100R026VBNR
U16 = CMP-365-000000-2: -4-V to 110-V, 1.3-MHz, ultra-precise current-sense amplifier with comparator 8-VSSOP -40 to 125; Manufacturer_Name: Texas Instruments; Design Item ID: INA310A2IDGKR; Copyright: Copyright (C) 2025 Ultra Librarian. All rights reserved.; Type: Linear; Source: INA310A2IDGKR.SchLib; Manufacturer_Part_Number: INA310A2IDGKR; RefDes: RefDes